# EasyEDA schematic MBt2_Carrier_Board_SCH.json
TITLE: Mini; REV: 1.1; Date: 2024-04-26; Sheet: 1/1; Drawn By: the.skuric; Company: SimpleFOC
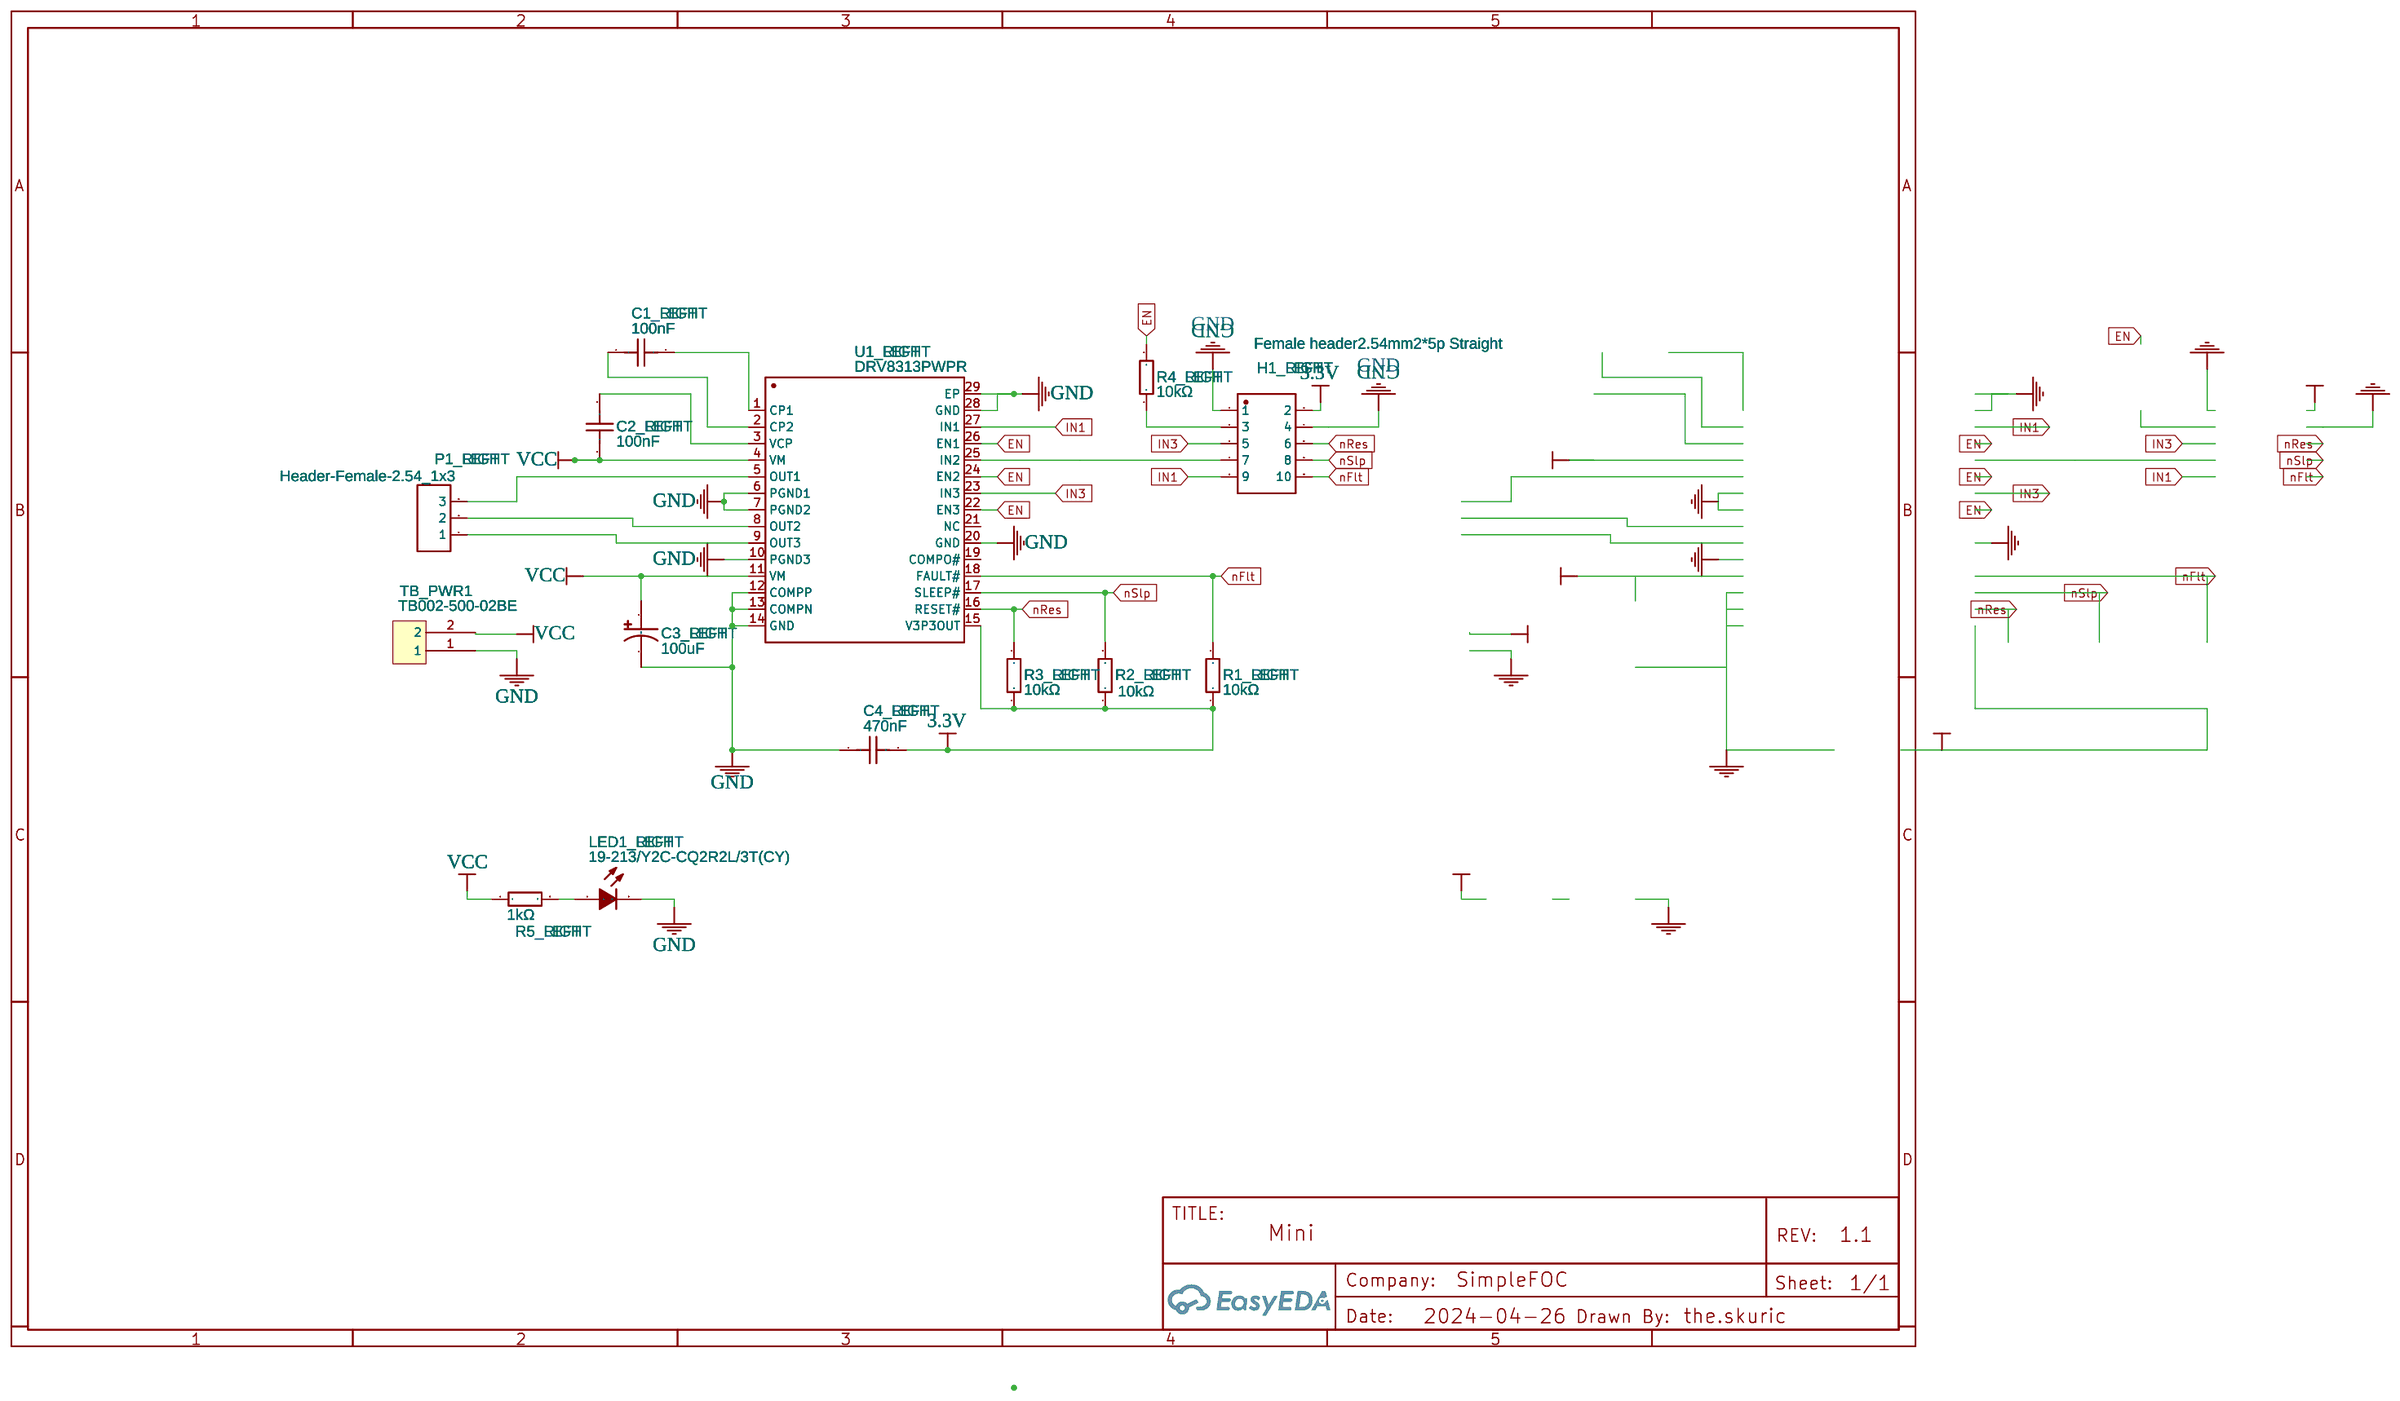
[diagram p0: schematic sheet]

## Parts
C1_LEFT  100nF  [C0603]
C1_RIGHT  100nF  [C0603]
C2_LEFT  100nF  [C0603]
C2_RIGHT  100nF  [C0603]
C3_LEFT  100uF  [CAP-SMD_BD6.3-L6.6-W6.6-FD]
C3_RIGHT  100uF  [CAP-SMD_BD6.3-L6.6-W6.6-FD]
C4_LEFT  470nF  [C0603]
C4_RIGHT  470nF  [C0603]
H1_LEFT  Female header2.54mm2*5p Straight  [HDR-TH_10P-P2.54-V-F-R2-C5-S2.54]
H1_RIGHT  Female header2.54mm2*5p Straight  [HDR-TH_10P-P2.54-V-F-R2-C5-S2.54]
LED1_LEFT  19-213/Y2C-CQ2R2L/3T(CY)  [LED0603-R-RD]
LED1_RIGHT  19-213/Y2C-CQ2R2L/3T(CY)  [LED0603-R-RD]
P1_LEFT  Header-Female-2.54_1x3  [HDR-TH_3P-P2.54-V-F]
P1_RIGHT  Header-Female-2.54_1x3  [HDR-TH_3P-P2.54-V-F]
R1_LEFT  10kΩ  [R0603]
R1_RIGHT  10kΩ  [R0603]
R2_LEFT  10kΩ  [R0603]
R2_RIGHT  10kΩ  [R0603]
R3_LEFT  10kΩ  [R0603]
R3_RIGHT  10kΩ  [R0603]
R4_LEFT  10kΩ  [R0603]
R4_RIGHT  10kΩ  [R0603]
R5_LEFT  1kΩ  [R0603]
R5_RIGHT  1kΩ  [R0603]
TB_PWR1  TB002-500-02BE  [TB002-500-02BE]
TB_PWR1#2  TB002-500-02BE  [TB002-500-02BE]
U1_LEFT  DRV8313PWPR  [HTSSOP-28_L9.8-W4.5-P0.65-LS6.6-BL-EP]
U1_RIGHT  DRV8313PWPR  [HTSSOP-28_L9.8-W4.5-P0.65-LS6.6-BL-EP]

## Library data of the parts
C1_LEFT C1_RIGHT C2_LEFT C2_RIGHT = CL10B104KB8NNNC: Supplier: LCSC; Manufacturer: SAMSUNG; Supplier Part: C1591
C3_LEFT C3_RIGHT = VT1V101M-CRE77: Supplier: LCSC; Supplier Part: C294520; Manufacturer: Vertical Technology; Contributor: LCSC
C4_LEFT C4_RIGHT = CC0603ZRY5V6BB474: Supplier: LCSC; Supplier Part: C327269; Manufacturer: YAGEO; Contributor: LCSC
H1_LEFT H1_RIGHT = Female header2.54mm2*5p Straight: Supplier Part: C30419; Supplier: LCSC; Manufacturer: ReliaPro; JLCPCB Part Class: Extended Part
LED1_LEFT LED1_RIGHT = 19-213/Y2C-CQ2R2L/3T(CY): Supplier: LCSC; Manufacturer: EVERLIGHT; Supplier Part: C72038; JLCPCB Part Class: Basic Part
P1_LEFT P1_RIGHT = Header-Female-2.54_1x3: Supplier Part: C146243; Supplier: LCSC; Manufacturer: Boom Precision Elec; link: https://datasheet.lcsc.com/szlcsc/Boom-Precision-Elec-2-54mm-1-8P-Straight-Female-header_C27438.pdf; JLCPCB Part Class: Extended Part
R1_LEFT R1_RIGHT R2_LEFT R2_RIGHT R3_LEFT R3_RIGHT R4_LEFT R4_RIGHT R5_LEFT R5_RIGHT = 0603WAF4701T5E: Supplier: LCSC; Manufacturer: UniOhm; Supplier Part: C23162; Resistance (Ohms): 4.7K; JLCPCB Part Class: Basic Part
TB_PWR1 TB_PWR1#2 = TB002-500-02BE: Supplier 1: Mouser; Supplier Part Number 1: 490-TB002-500-02BE; Contributor: the.skuric
U1_LEFT U1_RIGHT = DRV8313PWPR: Supplier: LCSC; Supplier Part: C92482; Manufacturer: Texas Instruments; Contributor: LCSC; JLCPCB Part Class: Extended Part

## Nets
3.3V: C4_LEFT.2 C4_RIGHT.2 H1_LEFT.2 H1_RIGHT.2 R1_LEFT.1 R1_RIGHT.1 R2_LEFT.1 R2_RIGHT.1 R3_LEFT.1 R3_RIGHT.1 U1_LEFT.15(V3P3OUT) U1_RIGHT.15(V3P3OUT)
GND: C3_LEFT.2 C3_RIGHT.2 C4_LEFT.1 C4_RIGHT.1 H1_LEFT.1 H1_LEFT.4 H1_RIGHT.1 H1_RIGHT.4 LED1_LEFT.2(C) LED1_RIGHT.2(C) TB_PWR1.1 TB_PWR1#2.1 U1_LEFT.6(PGND1) U1_LEFT.7(PGND2) U1_LEFT.10(PGND3) U1_LEFT.12(COMPP) U1_LEFT.13(COMPN) U1_LEFT.14(GND) U1_LEFT.20(GND) U1_LEFT.28(GND) U1_LEFT.29(EP) U1_RIGHT.6(PGND1) U1_RIGHT.7(PGND2) U1_RIGHT.10(PGND3) U1_RIGHT.12(COMPP) U1_RIGHT.13(COMPN) U1_RIGHT.14(GND) U1_RIGHT.20(GND) U1_RIGHT.28(GND) U1_RIGHT.29(EP)
VCC: C2_LEFT.1 C2_RIGHT.1 C3_LEFT.1 C3_RIGHT.1 R5_LEFT.1 R5_RIGHT.1 TB_PWR1.2 TB_PWR1#2.2 U1_LEFT.4(VM) U1_LEFT.11(VM) U1_RIGHT.4(VM) U1_RIGHT.11(VM)
EN: R4_LEFT.2 R4_RIGHT.2 U1_LEFT.22(EN3) U1_LEFT.24(EN2) U1_LEFT.26(EN1) U1_RIGHT.22(EN3) U1_RIGHT.24(EN2) U1_RIGHT.26(EN1)
IN1: H1_LEFT.9 H1_RIGHT.9 U1_LEFT.27(IN1) U1_RIGHT.27(IN1)
IN3: H1_LEFT.5 H1_RIGHT.5 U1_LEFT.23(IN3) U1_RIGHT.23(IN3)
nFlt: H1_LEFT.10 H1_RIGHT.10 R1_LEFT.2 R1_RIGHT.2 U1_LEFT.18(FAULT#) U1_RIGHT.18(FAULT#)
nRes: H1_LEFT.6 H1_RIGHT.6 R3_LEFT.2 R3_RIGHT.2 U1_LEFT.16(RESET#) U1_RIGHT.16(RESET#)
nSlp: H1_LEFT.8 H1_RIGHT.8 R2_LEFT.2 R2_RIGHT.2 U1_LEFT.17(SLEEP#) U1_RIGHT.17(SLEEP#)
Net-(C1_LEFT-1): C1_LEFT.1 C1_RIGHT.1 U1_LEFT.2(CP2) U1_RIGHT.2(CP2)
Net-(C1_LEFT-2): C1_LEFT.2 C1_RIGHT.2 U1_LEFT.1(CP1) U1_RIGHT.1(CP1)
Net-(C2_LEFT-2): C2_LEFT.2 C2_RIGHT.2 U1_LEFT.3(VCP) U1_RIGHT.3(VCP)
Net-(H1_LEFT-3): H1_LEFT.3 H1_RIGHT.3 R4_LEFT.1 R4_RIGHT.1
Net-(H1_LEFT-7): H1_LEFT.7 H1_RIGHT.7 U1_LEFT.25(IN2) U1_RIGHT.25(IN2)
Net-(LED1_LEFT-1): LED1_LEFT.1(A) LED1_RIGHT.1(A) R5_LEFT.2 R5_RIGHT.2
Net-(P1_LEFT-1): P1_LEFT.1 P1_RIGHT.1 U1_LEFT.9(OUT3) U1_RIGHT.9(OUT3)
Net-(P1_LEFT-2): P1_LEFT.2 P1_RIGHT.2 U1_LEFT.8(OUT2) U1_RIGHT.8(OUT2)
Net-(P1_LEFT-3): P1_LEFT.3 P1_RIGHT.3 U1_LEFT.5(OUT1) U1_RIGHT.5(OUT1)
Net-(U1_LEFT-19): U1_LEFT.19(COMPO#) U1_RIGHT.19(COMPO#)
Net-(U1_LEFT-21): U1_LEFT.21(NC) U1_RIGHT.21(NC)
